# Altium schematic sheet [02] - MCU.SchDoc: =ProjectName
size A4; CheckedBy: Ven; Author: Ven; CompanyName: HUST; Revision: V.1.0
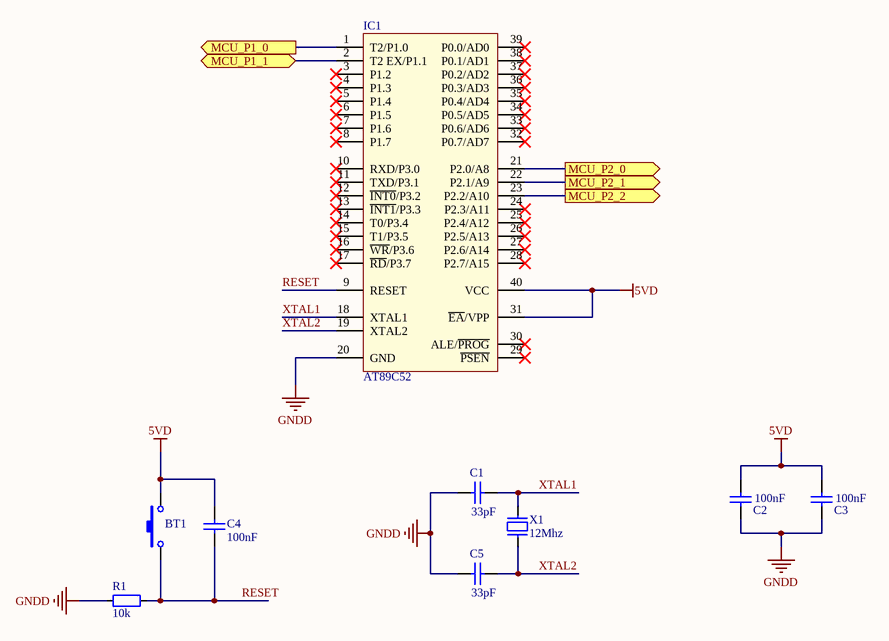
[diagram p0: [02] - MCU.SchDoc]

## Parts
BT1  SW2  [SW 3x2x4]  (value not drawn)
C1  33pF  [CAP_0805]
C2  100nF  [CAP_0805]
C3  100nF  [CAP_0805]
C4  100nF  [CAP_0805]
C5  33pF  [CAP_0805]
IC1  AT89C52  [DIP40/W0.6]
R1  10k  [RES-SMD-0805]
X1  12Mhz  [XT2]

## Ports
MCU_P1_0 (out), MCU_P1_1 (bidir), MCU_P2_0 (out), MCU_P2_1 (out), MCU_P2_2 (out)

## Nets
5VD: BT1.2 C2.2 C3.2 C4.2 IC1.31(~{EA}/VPP) IC1.40(VCC)
GNDD: C1.1 C2.1 C3.1 C5.1 IC1.20(GND) R1.2
MCU_P1_0: IC1.1(T2/P1.0) ; port MCU_P1_0
MCU_P1_1: IC1.2(T2_EX/P1.1) ; port MCU_P1_1
MCU_P2_0: IC1.21(P2.0/A8) ; port MCU_P2_0
MCU_P2_1: IC1.22(P2.1/A9) ; port MCU_P2_1
MCU_P2_2: IC1.23(P2.2/A10) ; port MCU_P2_2
RESET: BT1.1 C4.1 IC1.9(RESET) R1.1
XTAL1: C1.2 IC1.18(XTAL1) X1.1
XTAL2: C5.2 IC1.19(XTAL2) X1.2

Not connected (* = marked no-connect by the designer): IC1 3(P1.2)* 4(P1.3)* 5(P1.4)* 6(P1.5)* 7(P1.6)* 8(P1.7)* 10(RXD/P3.0)* 11(TXD/P3.1)* 12(~{INT0}/P3.2)* 13(~{INT1}/P3.3)* 14(T0/P3.4)* 15(T1/P3.5)* 16(~{WR}/P3.6)* 17(~{RD}/P3.7)* 24(P2.3/A11)* 25(P2.4/A12)* 26(P2.5/A13)* 27(P2.6/A14)* 28(P2.7/A15)* 29(~{PSEN})* 30(ALE/~{PROG})* 32(P0.7/AD7)* 33(P0.6/AD6)* 34(P0.5/AD5)* 35(P0.4/AD4)* 36(P0.3/AD3)* 37(P0.2/AD2)* 38(P0.1/AD1)* 39(P0.0/AD0)*

## Notes on the sheet
- Project:
- Page Contents:
- Size:
- Date:
- A4
- Checked by:
- Time:
- Revision:
- Sheet
- of
- File:

## Library data of the parts
BT1 = Nut Nhan 2 Chan SMD: SMD; Don_Vi: Con; Ma_Hang: MH001036; Ten_Linh_Kien: Nút Nhấn 2 Chân 3x6x2.5MM SMD; Chung_Loai: Dán; Ghi_Chu: *; Kieu_Chan: *
C1 C4 C5 = CapCeramic: Capacitor; Published: 8-Jun-2000; LatestRevisionDate: 17-Jul-2002; LatestRevisionNote: Re-released for DXP Platform.; PackageReference: RAD-0.3; Publisher: Altium Limited
C2 C3 = CapSMD: Capacitor; Value: 33p; Published: 8-Jun-2000; LatestRevisionDate: 17-Jul-2002; LatestRevisionNote: Re-released for DXP Platform.; PackageReference: RAD-0.3; Publisher: Altium Limited
IC1 = AT89C52: Atmel AT89C52, 8k Byte Flash Memory , 40 Pin; Value: AT89C52
R1 = Resistor - SMD: Resistor; Manufacturer: Generic Components; Class: Passive; Published: 08/06/2000; Publisher: Altium Hobart Technology Centre
X1 = XT2: Crystal For all Crystal 2pin.; Value: 4Mhz